# EAGLE design Control (EAGLE 9.6.2)
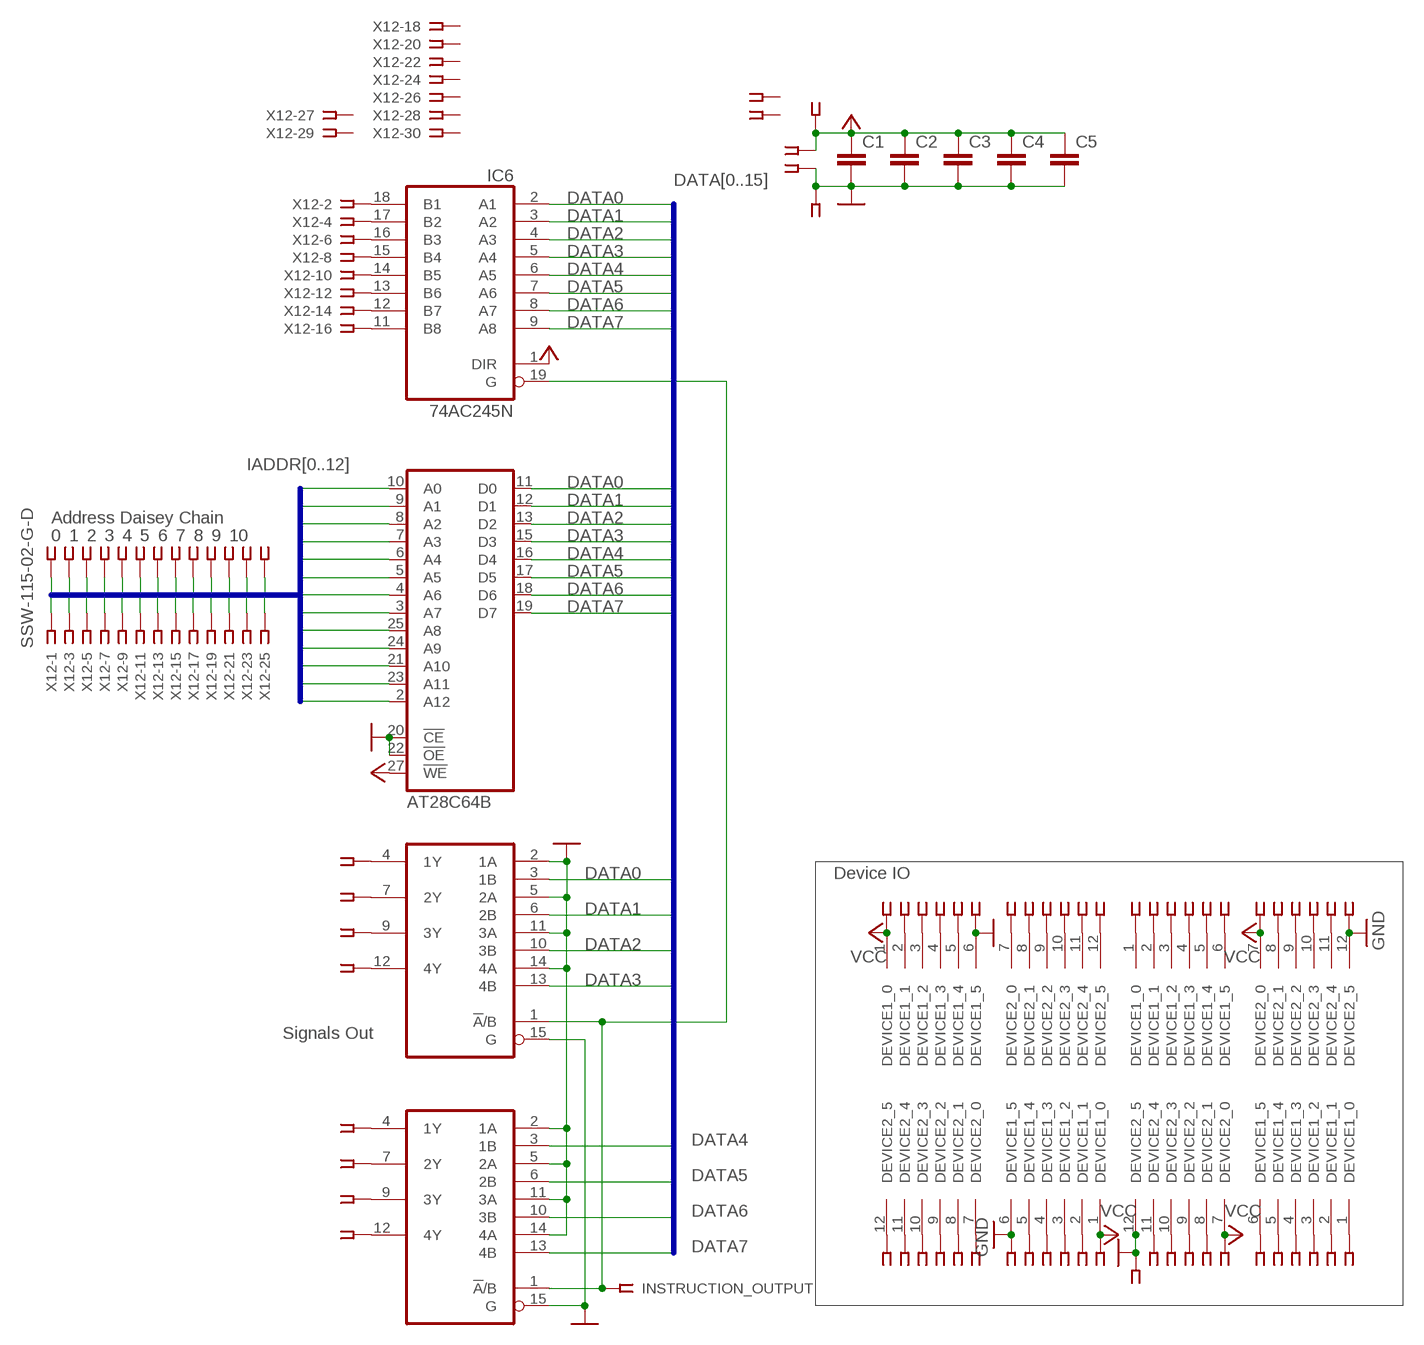
[diagram p0: schematic, sheet 1]

## Parts
C1  C2.5/2  [C2.5-2]
C2  C2.5/2  [C2.5-2]
C3  C2.5/2  [C2.5-2]
C4  C2.5/2  [C2.5-2]
C5  C2.5/2  [C2.5-2]
IC4  74AC157N  [DIL16]
IC5  74AC157N  [DIL16]
IC6  74AC245N  [DIL20]
INSTRUCTION_OUTPUT  SSW-101-02-G-S  [SSW-101-02-G-S]
U$1  CONTROL_SIG-INT  [CONTROL_SIG-INT-FOOT]
U$2  CONTROL_SIG-INT  [CONTROL_SIG-INT-FOOT]
U$3  AT28C64B  [DIP28-WIDE]
U$4  CONTROL_SIG-INT  [CONTROL_SIG-INT-FOOT]
U$5  CONTROL_SIG-INT  [CONTROL_SIG-INT-FOOT]
X1  SSW-106-02-G-S  [SSW-106-02-G-S]
X2  SSW-106-02-G-S  [SSW-106-02-G-S]
X3  SSW-106-02-G-S  [SSW-106-02-G-S]
X4  SSW-106-02-G-S  [SSW-106-02-G-S]
X5  SSW-108-02-G-S  [SSW-108-02-G-S]
X6  SSW-106-02-G-S  [SSW-106-02-G-S]
X7  SSW-106-02-G-S  [SSW-106-02-G-S]
X8  SSW-106-02-G-S  [SSW-106-02-G-S]
X9  SSW-106-02-G-S  [SSW-106-02-G-S]
X10  SSW-113-02-G-S  [SSW-113-02-G-S]
X11  SSW-102-02-G-S  [SSW-102-02-G-S]
X12  SSW-115-02-G-D  [SSW-115-02-G-D]
X13  SSW-104-02-G-S  [SSW-104-02-G-S]

## Nets
DATA0: IC4.3(1B) IC6.2(A1) U$3.11(D0)
DATA1: IC4.6(2B) IC6.3(A2) U$3.12(D1)
DATA2: IC4.10(3B) IC6.4(A3) U$3.13(D2)
DATA3: IC4.13(4B) IC6.5(A4) U$3.15(D3)
DATA4: IC5.3(1B) IC6.6(A5) U$3.16(D4)
DATA5: IC5.6(2B) IC6.7(A6) U$3.17(D5)
DATA6: IC5.10(3B) IC6.8(A7) U$3.18(D6)
DATA7: IC5.13(4B) IC6.9(A8) U$3.19(D7)
GND: C1.2 C2.2 C3.2 C4.2 C5.2 IC4.2(1A) IC4.5(2A) IC4.11(3A) IC4.14(4A) IC4.15(G) IC5.2(1A) IC5.5(2A) IC5.11(3A) IC5.14(4A) IC5.15(G) U$1.6(DEVICE1_5) U$2.12(DEVICE2_5) U$3.20(!CE) U$3.22(!OE) U$4.12(DEVICE2_5) U$5.6(DEVICE1_5) X1.1 X4.1 X7.1 X8.1 X11.2 X13.4
IADDR0: U$3.10(A0) X10.13 X12.1
IADDR1: U$3.9(A1) X10.12 X12.3
IADDR2: U$3.8(A2) X10.11 X12.5
IADDR3: U$3.7(A3) X10.10 X12.7
IADDR4: U$3.6(A4) X10.9 X12.9
IADDR5: U$3.5(A5) X10.8 X12.11
IADDR6: U$3.4(A6) X10.7 X12.13
IADDR7: U$3.3(A7) X10.6 X12.15
IADDR8: U$3.25(A8) X10.5 X12.17
IADDR9: U$3.24(A9) X10.4 X12.19
IADDR10: U$3.21(A10) X10.3 X12.21
IADDR11: U$3.23(A11) X10.2 X12.23
IADDR12: U$3.2(A12) X10.1 X12.25
N$1: U$2.6(DEVICE1_5) X6.1
N$2: U$2.5(DEVICE1_4) X6.2
N$3: U$2.4(DEVICE1_3) X6.3
N$4: U$2.3(DEVICE1_2) X6.4
N$5: U$2.2(DEVICE1_1) X6.5
N$6: U$2.1(DEVICE1_0) X6.6
N$8: U$2.11(DEVICE2_4) X7.2
N$9: U$2.10(DEVICE2_3) X7.3
N$10: U$2.9(DEVICE2_2) X7.4
N$11: U$2.8(DEVICE2_1) X7.5
N$13: U$4.6(DEVICE1_5) X3.1
N$14: U$4.5(DEVICE1_4) X3.2
N$15: U$4.4(DEVICE1_3) X3.3
N$16: U$4.3(DEVICE1_2) X3.4
N$17: U$4.2(DEVICE1_1) X3.5
N$18: U$4.1(DEVICE1_0) X3.6
N$20: U$4.11(DEVICE2_4) X4.2
N$21: U$4.10(DEVICE2_3) X4.3
N$22: U$4.9(DEVICE2_2) X4.4
N$23: U$4.8(DEVICE2_1) X4.5
N$26: U$5.5(DEVICE1_4) X1.2
N$27: U$5.4(DEVICE1_3) X1.3
N$28: U$5.3(DEVICE1_2) X1.4
N$29: U$5.2(DEVICE1_1) X1.5
N$31: U$5.12(DEVICE2_5) X2.1
N$32: U$5.11(DEVICE2_4) X2.2
N$33: U$5.10(DEVICE2_3) X2.3
N$34: U$5.9(DEVICE2_2) X2.4
N$35: U$5.8(DEVICE2_1) X2.5
N$36: U$5.7(DEVICE2_0) X2.6
N$38: U$1.5(DEVICE1_4) X8.2
N$39: U$1.4(DEVICE1_3) X8.3
N$40: U$1.3(DEVICE1_2) X8.4
N$41: U$1.2(DEVICE1_1) X8.5
N$43: U$1.12(DEVICE2_5) X9.1
N$44: U$1.11(DEVICE2_4) X9.2
N$45: U$1.10(DEVICE2_3) X9.3
N$46: U$1.9(DEVICE2_2) X9.4
N$47: U$1.8(DEVICE2_1) X9.5
N$48: U$1.7(DEVICE2_0) X9.6
N$49: IC6.18(B1) X12.2
N$50: IC6.17(B2) X12.4
N$51: IC6.16(B3) X12.6
N$52: IC6.15(B4) X12.8
N$53: IC6.14(B5) X12.10
N$54: IC6.13(B6) X12.12
N$55: IC6.12(B7) X12.14
N$56: IC6.11(B8) X12.16
N$101: IC5.12(4Y) X5.1
N$102: IC5.9(3Y) X5.2
N$104: IC4.1(!A!/B) IC5.1(!A!/B) IC6.19(G) INSTRUCTION_OUTPUT.1
N$105: IC5.7(2Y) X5.3
N$106: IC5.4(1Y) X5.4
N$107: IC4.12(4Y) X5.5
N$108: IC4.9(3Y) X5.6
N$109: IC4.7(2Y) X5.7
N$110: IC4.4(1Y) X5.8
VCC: C1.1 C2.1 C3.1 C4.1 C5.1 IC6.1(DIR) U$1.1(DEVICE1_0) U$2.7(DEVICE2_0) U$3.27(!WE) U$4.7(DEVICE2_0) U$5.1(DEVICE1_0) X1.6 X4.6 X7.6 X8.6 X11.1 X13.1
Unconnected: U$3.1 U$3.26 X12.18 X12.20 X12.22 X12.24 X12.26 X12.27 X12.28 X12.29 X12.30 X13.2 X13.3

## Buses
IADDR[0..12]
DATA[0..15]

## Notes on the sheet
- Address Daisey Chain
- 0 | 1 | 2 | 3 | 4 | 5 | 6 | 7 | 8 | 9 | 10
- Device IO
- Signals Out

## Power pins joined to a net without a drawn wire
GND: IC4.8(GND) IC5.8(GND) IC6.10(GND) U$3.14(GND)
VCC: IC4.16(VCC) IC5.16(VCC) IC6.20(VCC) U$3.28(VCC)

## Library data of the parts
C1-C5 = capacitor-wima:C: CAPACITOR naming: grid - package width
IC4 IC5 = 74xx-eu:74*157: Quadruple 2-line to 1-line data SELECTOR/MULTIPLEXER
IC6 = 74xx-eu:74*245: Octal BUS TRANSCEIVER, 3-state
INSTRUCTION_OUTPUT = con-samtec:SSW-101-02-G-S: THROUGH-HOLE .025" SQ POST SOCKET Source: Samtec SSW.pdf; MF: Samtec Inc.; MPN: SSW-101-02-G-S; OC_FARNELL: unknown; OC_NEWARK: 11P9336
U$1 U$2 U$4 U$5 = Computer:CONTROL_SIG-INT
U$3 = Computer:AT28C64B
X1-X4 X6-X9 = con-samtec:SSW-106-02-G-S: THROUGH-HOLE .025" SQ POST SOCKET Source: Samtec SSW.pdf; MF: Samtec Inc.; MPN: SSW-106-02-G-S; OC_FARNELL: unknown; OC_NEWARK: 11P9416
X5 = con-samtec:SSW-108-02-G-S: THROUGH-HOLE .025" SQ POST SOCKET Source: Samtec SSW.pdf; MF: Samtec Inc.; MPN: SSW-108-02-G-S; OC_FARNELL: unknown; OC_NEWARK: 11P9448
X10 = con-samtec:SSW-113-02-G-S: THROUGH-HOLE .025" SQ POST SOCKET Source: Samtec SSW.pdf; MF: Samtec Inc.; MPN: SSW-113-02-G-S; OC_FARNELL: unknown; OC_NEWARK: 11P9532
X11 = con-samtec:SSW-102-02-G-S: THROUGH-HOLE .025" SQ POST SOCKET Source: Samtec SSW.pdf; MF: Samtec Inc.; MPN: SSW-102-02-G-S; OC_FARNELL: unknown; OC_NEWARK: 11P9351
X12 = con-samtec:SSW-115-02-G: THROUGH-HOLE .025" SQ POST SOCKET Source: Samtec SSW.pdf; MF: Samtec Inc.; MPN: SSW-115-02-G-D; OC_FARNELL: unknown; OC_NEWARK: 11P9563
X13 = con-samtec:SSW-104-02-G-S: THROUGH-HOLE .025" SQ POST SOCKET Source: Samtec SSW.pdf; MF: Samtec Inc.; MPN: SSW-104-02-G-S; OC_FARNELL: unknown; OC_NEWARK: 11P9384

## Board
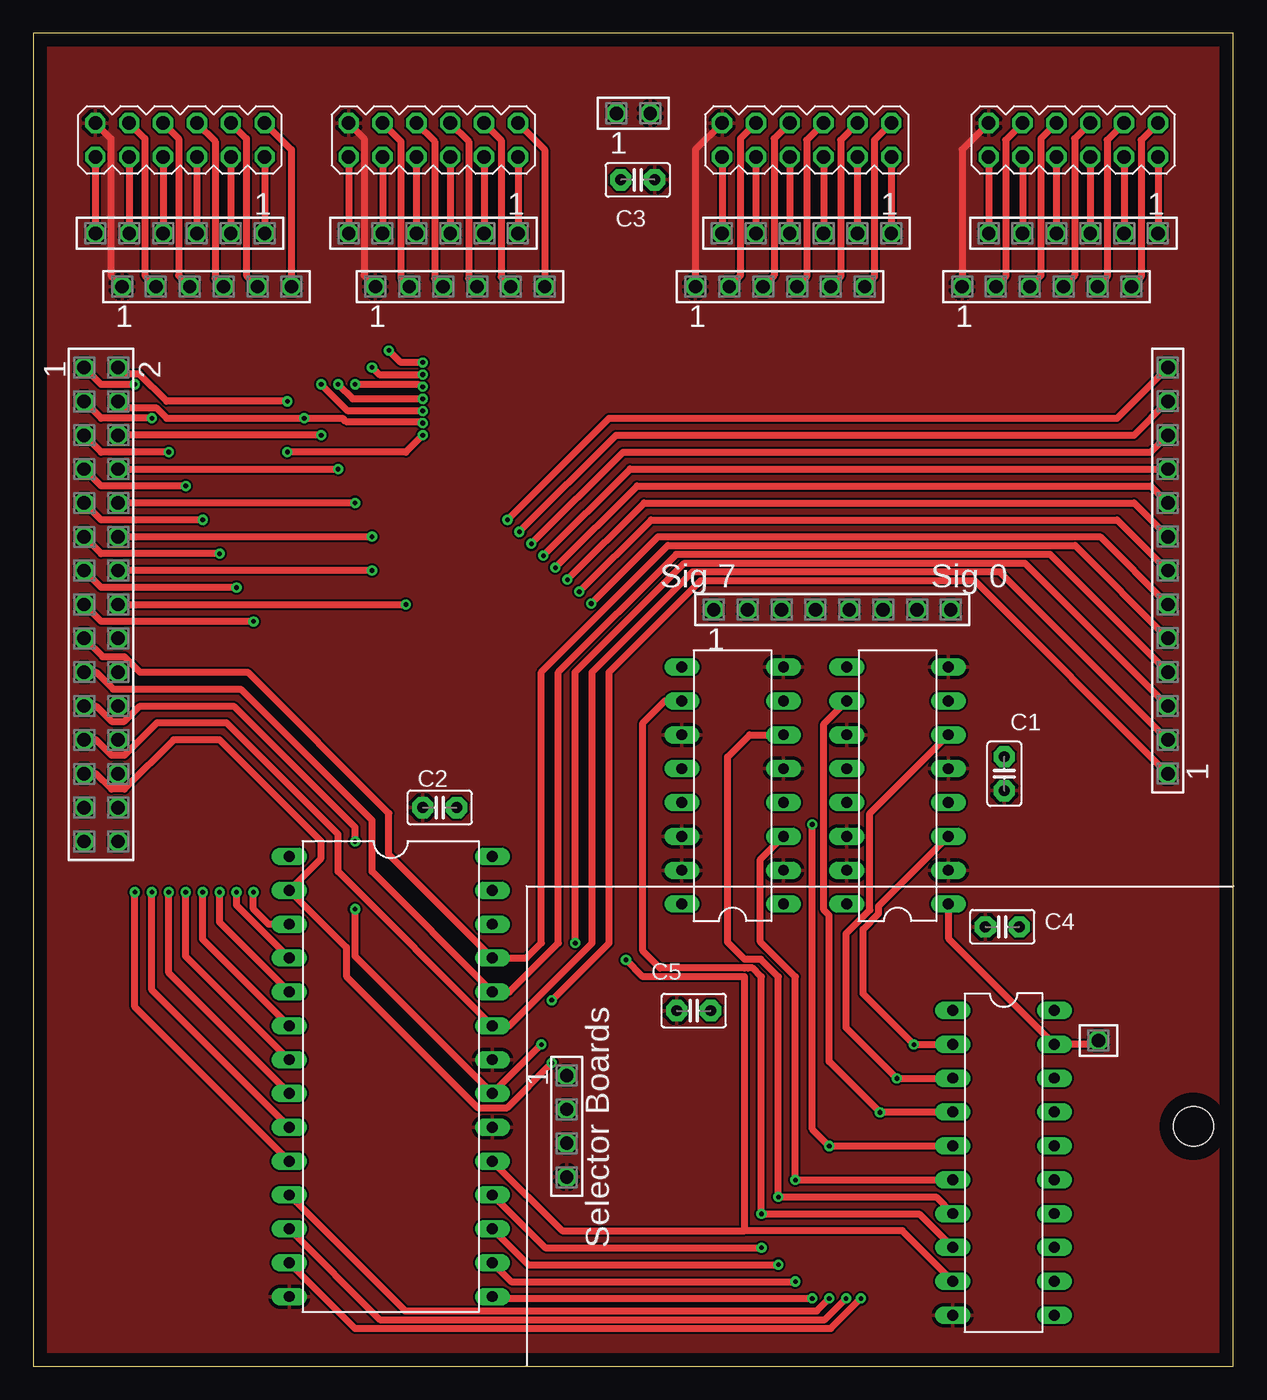
[diagram p1: board, top side]
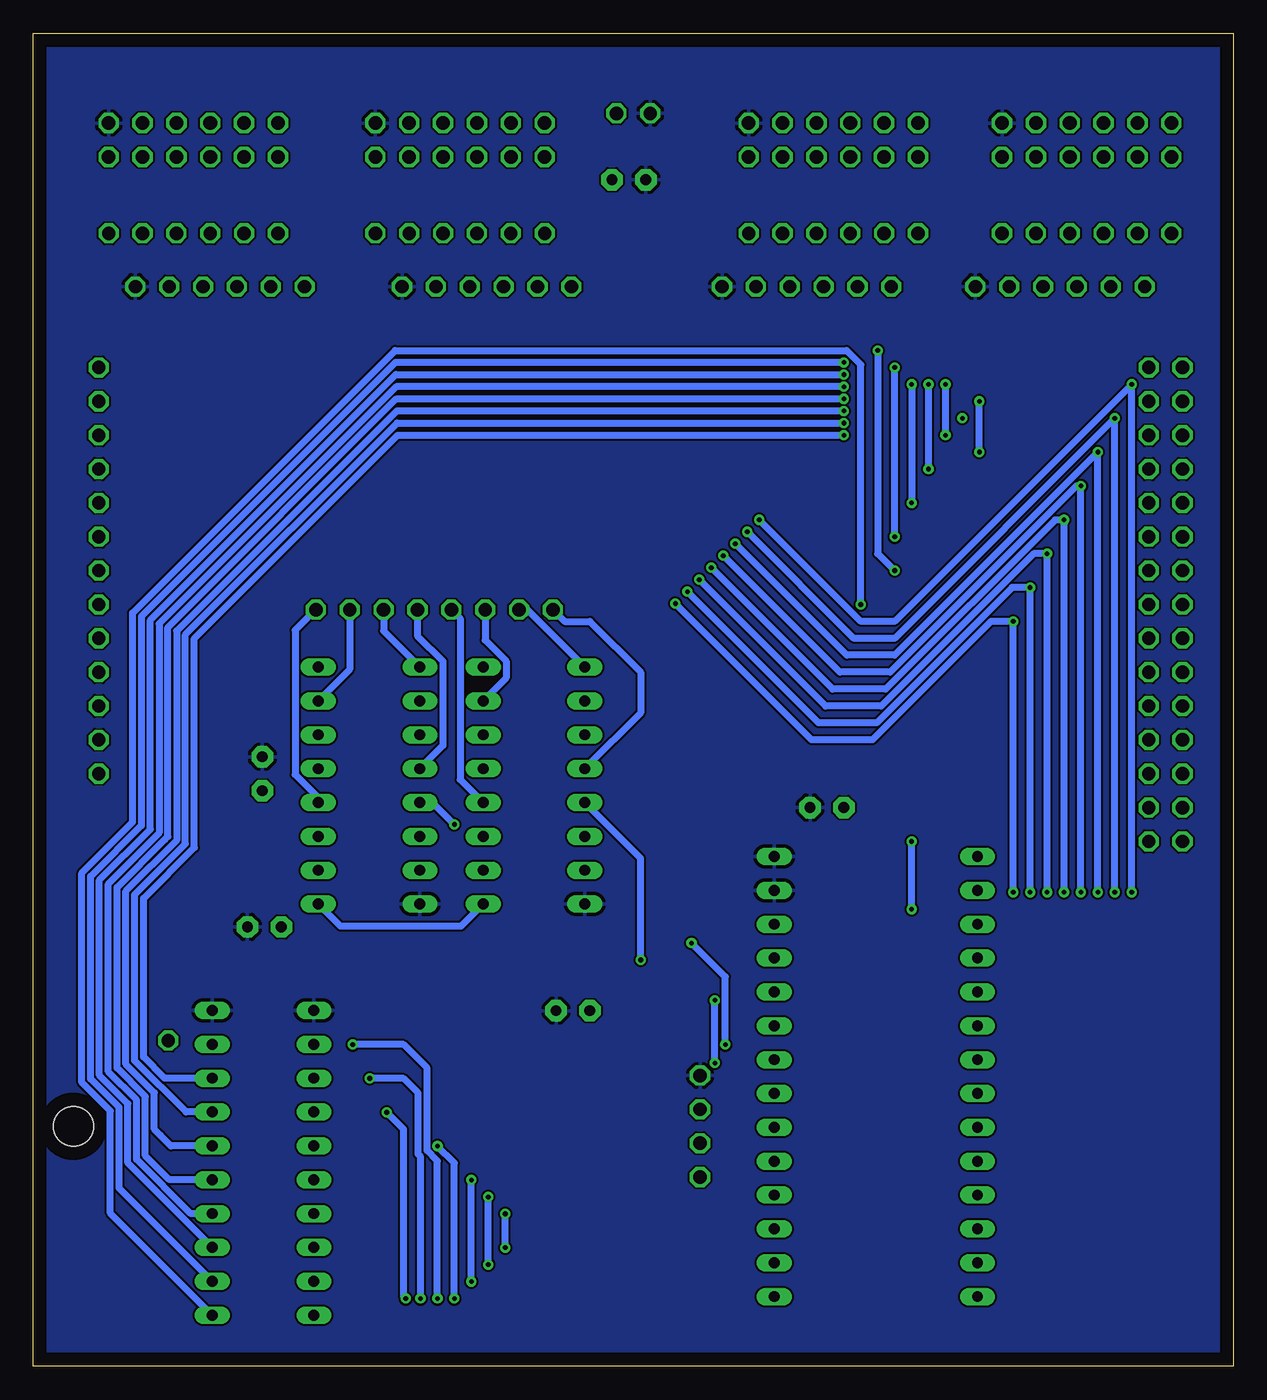
[diagram p2: board, bottom side, seen from below]

Size 90 x 100 mm. Coordinates in mm from the lower left corner, seen from the top.
Outline: 0,0 90,0 90,100 0,100 0,0
Copper layers (1*16): Top 0.035mm / dielectric 1.5mm / Bottom 0.035mm
Design rules "default": minimum track width 6mil, minimum drill 0.35mm, track to track 6mil, track to pad 6mil, pad to pad 6mil, via to via 6mil, smd to smd 6mil, copper to edge 40mil, drill to drill 6mil, minimum pad ring 10mil, minimum via ring 8mil, stop-mask expansion 4mil, vias tented up to drill 0mil, thermal gap 10mil
Holes 3 mm at 87,18

### Footprints (pad centres in the part's own frame; a part is rotated, then mirrored left to right if it is on the bottom)
C2.5-2 = drill 0.813 pad 1.6 octagon: 1 -1.27,0; 2 1.27,0
DIL16 = drill 0.813 long: 1 -8.89,-3.81; 2 -6.35,-3.81; 3 -3.81,-3.81; 4 -1.27,-3.81; 5 1.27,-3.81; 6 3.81,-3.81; 7 6.35,-3.81; 8 8.89,-3.81; 9 8.89,3.81; 10 6.35,3.81; 11 3.81,3.81; 12 1.27,3.81; 13 -1.27,3.81; 14 -3.81,3.81; 15 -6.35,3.81; 16 -8.89,3.81
DIL20 = drill 0.813 long: 1 -11.43,-3.81; 2 -8.89,-3.81; 3 -6.35,-3.81; 4 -3.81,-3.81; 5 -1.27,-3.81; 6 1.27,-3.81; 7 3.81,-3.81; 8 6.35,-3.81; 9 8.89,-3.81; 10 11.43,-3.81; 11 11.43,3.81; 12 8.89,3.81; 13 6.35,3.81; 14 3.81,3.81; 15 1.27,3.81; 16 -1.27,3.81; 17 -3.81,3.81; 18 -6.35,3.81; 19 -8.89,3.81; 20 -11.43,3.81
SSW-101-02-G-S = drill 1 pad 1.5 octagon: 1 0,0
CONTROL_SIG-INT-FOOT = drill 1.016 octagon: 1 -6.35,-1.27; 2 -3.81,-1.27; 3 -1.27,-1.27; 4 1.27,-1.27; 5 3.81,-1.27; 6 6.35,-1.27; 7 6.35,1.27; 8 3.81,1.27; 9 1.27,1.27; 10 -1.27,1.27; 11 -3.81,1.27; 12 -6.35,1.27
DIP28-WIDE = drill 0.813 long: 1 -16.51,-7.62; 2 -13.97,-7.62; 3 -11.43,-7.62; 4 -8.89,-7.62; 5 -6.35,-7.62; 6 -3.81,-7.62; 7 -1.27,-7.62; 8 1.27,-7.62; 9 3.81,-7.62; 10 6.35,-7.62; 11 8.89,-7.62; 12 11.43,-7.62; 13 13.97,-7.62; 14 16.51,-7.62; 15 16.51,7.62; 16 13.97,7.62; 17 11.43,7.62; 18 8.89,7.62; 19 6.35,7.62; 20 3.81,7.62; 21 1.27,7.62; 22 -1.27,7.62; 23 -3.81,7.62; 24 -6.35,7.62; 25 -8.89,7.62; 26 -11.43,7.62; 27 -13.97,7.62; 28 -16.51,7.62
SSW-106-02-G-S = drill 1 pad 1.5 octagon: 1 -6.35,0; 2 -3.81,0; 3 -1.27,0; 4 1.27,0; 5 3.81,0; 6 6.35,0
SSW-108-02-G-S = drill 1 pad 1.5 octagon: 1 -8.89,0; 2 -6.35,0; 3 -3.81,0; 4 -1.27,0; 5 1.27,0; 6 3.81,0; 7 6.35,0; 8 8.89,0
SSW-113-02-G-S = drill 1 pad 1.5 octagon: 1 -15.24,0; 2 -12.7,0; 3 -10.16,0; 4 -7.62,0; 5 -5.08,0; 6 -2.54,0; 7 0,0; 8 2.54,0; 9 5.08,0; 10 7.62,0; 11 10.16,0; 12 12.7,0; 13 15.24,0
SSW-102-02-G-S = drill 1 pad 1.5 octagon: 1 -1.27,0; 2 1.27,0
SSW-115-02-G-D = drill 1 pad 1.5 octagon: 1 -17.78,-1.27; 2 -17.78,1.27; 3 -15.24,-1.27; 4 -15.24,1.27; 5 -12.7,-1.27; 6 -12.7,1.27; 7 -10.16,-1.27; 8 -10.16,1.27; 9 -7.62,-1.27; 10 -7.62,1.27; 11 -5.08,-1.27; 12 -5.08,1.27; 13 -2.54,-1.27; 14 -2.54,1.27; 15 0,-1.27; 16 0,1.27; 17 2.54,-1.27; 18 2.54,1.27; 19 5.08,-1.27; 20 5.08,1.27; 21 7.62,-1.27; 22 7.62,1.27; 23 10.16,-1.27; 24 10.16,1.27; 25 12.7,-1.27; 26 12.7,1.27; 27 15.24,-1.27; 28 15.24,1.27; 29 17.78,-1.27; 30 17.78,1.27
SSW-104-02-G-S = drill 1 pad 1.5 octagon: 1 -3.81,0; 2 -1.27,0; 3 1.27,0; 4 3.81,0

### Placement (x,y rotation side)
C1  72.82,44.45 270 top
C2  30.48,41.91 180 top
C3  45.33,89.01 0 top
C4  72.67,32.96 180 top
C5  49.53,26.67 180 top
IC4  64.82,43.56 90 top
IC5  52.45,43.56 90 top
IC6  72.77,15.26 270 top
INSTRUCTION_OUTPUT  79.88,24.43 0 top
U$1  78,92 180 top
U$2  58,92 0 top
U$3  26.81,21.73 270 top
U$4  30,92 0 top
U$5  11,92 180 top
X1  13,81 0 top
X2  11,85 180 top
X3  30,85 180 top
X4  32,81 0 top
X5  59.92,56.76 0 top
X6  58,85 180 top
X7  56,81 0 top
X8  76,81 0 top
X9  78,85 180 top
X10  85.09,59.69 90 top
X11  45,94 0 top
X12  5.08,57.15 270 top
X13  40,18 270 top

### Tracks (layer width: path | path; a pad name or v marks a point on that pad's centre or on a via)
DATA0  (via drill 0.35)
  Top 0.508: U$3.11 27.88,4.15 58.76,4.15 v59.69,5.08 | IC6.2 68.94,24.13 v66.04,24.13 62.23,27.94 62.23,32.79 63.4,33.95 63.4,34.52 IC4.3
  Bottom 0.508: v59.69,5.08 59.69,15.4 60.48,16.18 60.48,22.38 62.23,24.13 v66.04,24.13
DATA1  (via drill 0.35)
  Top 0.508: U$3.12 26,3.49 59.37,3.49 v60.96,5.08 | IC6.3 64.79,21.61 v64.77,21.59 60.96,25.4 60.96,32.45 62.74,34.23 62.74,41.48 IC4.6
  Bottom 0.508: v60.96,5.08 60.96,15.74 61.13,15.91 61.13,20.5 62.23,21.59 v64.77,21.59
DATA2  (via drill 0.35)
  Top 0.508: U$3.13 24.12,2.83 59.82,2.83 v62.07,5.08 | IC6.4 63.52,19.07 v63.5,19.05 59.69,22.86 59.69,33.82 59.28,34.23 59.28,48.18 IC4.10
  Bottom 0.508: v62.07,5.08 62.23,5.24 62.23,17.78 v63.5,19.05
DATA3  (via drill 0.35)
  Top 0.508: U$3.15 34.57,5.08 v58.42,5.08 | IC6.5 59.71,16.53 v59.69,16.51 58.42,17.78 v58.42,40.64
  Bottom 0.508: v58.42,5.08 58.42,15.24 v59.69,16.51 | v58.42,40.64 60.07,42.29 IC4.13
DATA4  (via drill 0.35)
  Top 0.508: U$3.16 35.84,6.35 v57.15,6.35 | IC6.6 57.17,13.99 v57.15,13.97 57.15,29.21 54.53,31.83 54.53,38.02 IC5.3
  Bottom 0.508: v57.15,6.35 v57.15,13.97
DATA5  (via drill 0.35)
  Top 0.508: U$3.17 37.11,7.62 v55.88,7.62 | IC6.7 67.71,12.7 v55.88,12.7 55.88,29.21 54.56,30.53 53.34,30.53 52.07,31.8 52.07,45.72 53.72,47.37 IC5.6
  Bottom 0.508: v55.88,7.62 v55.88,12.7
DATA6  (via drill 0.35)
  Top 0.508: U$3.18 38.38,8.89 v54.61,8.89 | IC6.8 66.44,11.43 v54.61,11.43 54.61,29.21 53.95,29.87 53.61,29.87 53.34,29.87 46.99,29.87 45.72,31.14 45.72,48.26 47.37,49.91 IC5.10
  Bottom 0.508: v54.61,8.89 v54.61,11.43
DATA7  (via drill 0.35)
  Top 0.508: U$3.19 39.65,10.16 53.34,10.16 | IC6.9 65.17,10.16 53.34,10.16 | 53.34,10.16 53.34,29.21 45.72,29.21 v44.45,30.48
  Bottom 0.508: v44.45,30.48 44.45,38.1 IC5.13
GND
  Top 0.508: X1.1 5.82,81.83 5.82,92.1 U$5.6 | X4.1 24.82,81.83 24.82,92.1 U$4.12 | X7.1 49.65,91.27 U$2.12 | X8.1 69.65,91.27 U$1.6
  pour Top: 0,100 90,100 90,0 0,0
IADDR0  (via drill 0.35)
  Top 0.508: U$3.10 7.62,26.95 v7.62,35.56 | v7.62,73.66 5.08,73.66 X12.1 | v35.56,63.5 43.18,71.12 81.28,71.12 X10.13
  Bottom 0.508: v7.62,35.56 v7.62,73.66 25.4,55.88 27.94,55.88 v35.56,63.5
IADDR1  (via drill 0.35)
  Top 0.508: U$3.9 8.89,28.22 v8.89,35.56 | v8.89,71.12 5.08,71.12 X12.3 | v36.46,62.6 43.71,69.85 82.55,69.85 X10.12
  Bottom 0.508: v8.89,35.56 v8.89,71.12 25.4,54.61 28.47,54.61 v36.46,62.6
IADDR2  (via drill 0.35)
  Top 0.508: U$3.8 10.16,29.49 v10.16,35.56 | v10.16,68.58 5.08,68.58 X12.5 | v37.36,61.7 44.23,68.58 83.82,68.58 X10.11
  Bottom 0.508: v10.16,35.56 v10.16,68.58 25.4,53.34 28.99,53.34 v37.36,61.7
IADDR3  (via drill 0.35)
  Top 0.508: U$3.7 11.43,30.76 v11.43,35.56 | v11.43,66.04 5.08,66.04 X12.7 | v38.25,60.81 44.76,67.31 X10.10
  Bottom 0.508: v11.43,35.56 v11.43,66.04 11.77,66.04 25.74,52.07 29.52,52.07 v38.25,60.81
IADDR4  (via drill 0.35)
  Top 0.508: U$3.6 12.7,32.03 v12.7,35.56 | v12.7,63.5 5.08,63.5 X12.9 | v39.15,59.91 45.28,66.04 83.82,66.04 X10.9
  Bottom 0.508: v12.7,35.56 v12.7,63.5 13.37,63.5 26.07,50.8 30.04,50.8 v39.15,59.91
IADDR5  (via drill 0.35)
  Top 0.508: U$3.5 13.97,33.3 v13.97,35.56 | v13.97,60.96 5.08,60.96 X12.11 | v40.05,59.01 45.81,64.77 82.55,64.77 X10.8
  Bottom 0.508: v13.97,35.56 v13.97,60.96 14.98,60.96 26.41,49.53 30.57,49.53 v40.05,59.01
IADDR6  (via drill 0.35)
  Top 0.508: U$3.4 15.24,34.57 v15.24,35.56 | v15.24,58.42 5.08,58.42 X12.13 | v40.95,58.11 46.34,63.5 81.28,63.5 X10.7
  Bottom 0.508: v15.24,35.56 v15.24,58.42 16.58,58.42 26.74,48.26 31.1,48.26 v40.95,58.11
IADDR7  (via drill 0.35)
  Top 0.508: U$3.3 17.64,33.16 16.51,34.29 v16.51,35.56 | v16.51,55.88 5.08,55.88 X12.15 | v41.85,57.21 46.86,62.23 80.01,62.23 X10.6
  Bottom 0.508: v16.51,35.56 v16.51,55.88 18.19,55.88 27.08,46.99 31.62,46.99 v41.85,57.21
IADDR8
  Top 0.508: X12.17 5.19,53.23 6.83,53.23 7.99,52.07 16.07,52.07 26.67,41.47 26.67,38.38 U$3.25 36.97,30.62 38.1,31.75 38.1,52.07 47.6,61.57 78.13,61.57 X10.5
IADDR9
  Top 0.508: X12.19 4.71,52.07 5.98,50.8 15.55,50.8 25.4,40.95 25.4,37.11 U$3.24 35.7,28.08 39.37,31.75 39.37,52.07 48.21,60.91 76.25,60.91 X10.4
IADDR10  (via drill 0.35)
  Top 0.508: v24.13,34.29 24.13,30.76 U$3.21 v38.1,24.13 | v24.13,39.37 24.13,40.42 15.02,49.53 7.99,49.53 6.83,48.37 5.87,48.37 4.71,49.53 X12.21 | v40.64,31.75 40.64,52.07 48.82,60.25 74.37,60.25 X10.3
  Bottom 0.508: v24.13,34.29 v24.13,39.37 | v38.1,24.13 38.1,29.21 v40.64,31.75
IADDR11
  Top 0.508: X12.23 4.71,46.99 5.87,45.83 6.83,45.83 9.26,48.26 14.5,48.26 22.86,39.9 22.86,37.11 U$3.23 35.7,25.54 41.91,31.75 41.91,52.07 49.43,59.59 72.49,59.59 X10.2
IADDR12  (via drill 0.35)
  Top 0.508: X12.25 4.71,44.45 5.87,43.29 6.83,43.29 10.53,46.99 13.97,46.99 21.59,39.37 21.59,38.1 U$3.2 23.47,31.42 23.47,29.25 33.33,19.39 35.53,19.39 v38.88,22.75 | v38.88,27.45 43.18,31.75 43.18,52.07 50.04,58.93 70.61,58.93 X10.1
  Bottom 0.508: v38.88,22.75 v38.88,27.45
N$1
  Top 0.508: U$2.6 X6.1
N$2
  Top 0.508: U$2.5 X6.2
N$3
  Top 0.508: U$2.4 X6.3
N$4
  Top 0.508: U$2.3 X6.4
N$5
  Top 0.508: U$2.2 X6.5
N$6
  Top 0.508: U$2.1 X6.6
N$8
  Top 0.508: X7.2 53.02,81.83 53.02,92.1 U$2.11
N$9
  Top 0.508: X7.3 55.56,81.83 55.56,92.1 U$2.10
N$10
  Top 0.508: X7.4 58,81.73 58,92 U$2.9
N$11
  Top 0.508: X7.5 60.54,81.73 60.54,92 U$2.8
N$13
  Top 0.508: U$4.6 X3.1
N$14
  Top 0.508: U$4.5 X3.2
N$15
  Top 0.508: U$4.4 X3.3
N$16
  Top 0.508: U$4.3 X3.4
N$17
  Top 0.508: U$4.2 X3.5
N$18
  Top 0.508: U$4.1 X3.6
N$20
  Top 0.508: X4.2 27.56,81.63 27.56,91.9 U$4.11
N$21
  Top 0.508: X4.3 30.1,81.63 30.1,91.9 U$4.10
N$22
  Top 0.508: X4.4 32.64,81.63 32.64,91.9 U$4.9
N$23
  Top 0.508: X4.5 35.08,81.73 35.08,92 U$4.8
N$26
  Top 0.508: X1.2 8.36,81.83 8.36,92.1 U$5.5
N$27
  Top 0.508: X1.3 10.9,81.83 10.9,92.1 U$5.4
N$28
  Top 0.508: X1.4 13.64,81.63 13.64,91.9 U$5.3
N$29
  Top 0.508: X1.5 15.98,81.83 15.98,92.1 U$5.2
N$31
  Top 0.508: U$5.12 X2.1
N$32
  Top 0.508: U$5.11 X2.2
N$33
  Top 0.508: U$5.10 X2.3
N$34
  Top 0.508: U$5.9 X2.4
N$35
  Top 0.508: U$5.8 X2.5
N$36
  Top 0.508: U$5.7 X2.6
N$38
  Top 0.508: X8.2 72.92,81.73 72.92,92 U$1.5
N$39
  Top 0.508: X8.3 75.56,81.83 75.56,92.1 U$1.4
N$40
  Top 0.508: X8.4 78.1,81.83 78.1,92.1 U$1.3
N$41
  Top 0.508: X8.5 80.54,81.73 80.54,92 U$1.2
N$43
  Top 0.508: U$1.12 X9.1
N$44
  Top 0.508: U$1.11 X9.2
N$45
  Top 0.508: U$1.10 X9.3
N$46
  Top 0.508: U$1.9 X9.4
N$47
  Top 0.508: U$1.8 X9.5
N$48
  Top 0.508: U$1.7 X9.6
N$49  (via drill 0.35)
  Top 0.508: v29.21,69.85 27.94,68.58 v19.05,68.58 | X12.2 6.83,74.44 7.95,74.44 10,72.39 v19.05,72.39
  Bottom 0.508: IC6.18 80.16,21.61 81.74,23.19 81.74,35.1 77.93,38.91 77.93,54.61 62.69,69.85 v29.21,69.85 | v19.05,68.58 v19.05,72.39
N$50  (via drill 0.35)
  Top 0.508: X12.4 6.83,71.91 9.21,71.91 10,71.12 v20.32,71.12 23.2,71.12 23.43,70.88 29.09,70.88 v29.21,70.76
  Bottom 0.508: IC6.17 78.55,19.07 82.4,22.92 82.4,35.38 78.59,39.19 78.59,54.88 62.71,70.76 v29.21,70.76
N$51  (via drill 0.35)
  Top 0.508: v29.21,71.67 23.58,71.67 v21.59,73.66 | v21.59,69.85 X12.6
  Bottom 0.508: IC6.16 79.68,16.53 80.47,17.32 80.93,17.78 80.93,20.52 83.06,22.64 83.06,35.65 79.25,39.46 79.25,55.16 62.74,71.67 v29.21,71.67 | v21.59,73.66 v21.59,69.85
N$52  (via drill 0.35)
  Top 0.508: X12.8 v22.86,67.31 | v22.86,73.66 23.94,72.58 v29.21,72.58
  Bottom 0.508: IC6.15 79.79,13.99 81.59,15.79 81.59,20.24 83.72,22.37 83.72,35.92 80.14,39.5 79.91,39.73 79.91,55.43 62.76,72.58 v29.21,72.58 | v22.86,67.31 v22.86,73.66
N$53  (via drill 0.35)
  Top 0.508: v29.21,73.48 29.09,73.61 28.89,73.61 28.83,73.66 v24.13,73.66 | v24.13,64.77 X12.10
  Bottom 0.508: IC6.14 78.19,11.45 82.25,15.51 82.25,19.97 84.38,22.1 84.38,36.2 80.57,40.01 80.57,55.7 62.79,73.48 v29.21,73.48 | v24.13,73.66 v24.13,64.77
N$54  (via drill 0.35)
  Top 0.508: X12.12 v25.4,62.23 | v25.4,74.93 25.94,74.39 v29.21,74.39
  Bottom 0.508: IC6.13 82.91,15.24 82.91,19.69 85.04,21.82 85.04,36.47 81.23,40.28 81.23,55.98 62.81,74.39 v29.21,74.39 | v25.4,62.23 v25.4,74.93
N$55  (via drill 0.35)
  Top 0.508: v29.21,75.3 27.57,75.3 v26.67,76.2 | v25.4,59.69 X12.14
  Bottom 0.508: IC6.12 83.57,13.36 83.57,19.42 85.7,21.55 85.7,36.74 81.89,40.55 81.89,56.25 62.84,75.3 v29.21,75.3 | v26.67,76.2 26.67,60.96 v25.4,59.69
N$56  (via drill 0.35)
  Top 0.508: X12.16 v27.94,57.15
  Bottom 0.508: IC6.11 84.23,11.48 84.23,19.15 86.36,21.28 86.36,37.02 82.55,40.83 82.55,56.52 62.86,76.21 29.01,76.21 27.94,75.14 v27.94,57.15
N$101
  Bottom 0.508: IC5.12 44.45,49.02 44.45,52.07 48.26,55.88 50.15,55.88 X5.1
N$102
  Bottom 0.508: X5.2 52.95,56.76 IC5.9
N$104
  Top 0.508: INSTRUCTION_OUTPUT.1 79.6,24.15 IC6.19 68.63,32.1 IC4.1
  Bottom 0.508: IC4.1 66.98,33.02 57.91,33.02 IC5.1
N$105
  Bottom 0.508: X5.3 56.11,54.47 54.53,52.89 54.53,51.64 IC5.7
N$106
  Bottom 0.508: X5.4 57.99,56.1 57.99,44.02 IC5.4
N$107
  Bottom 0.508: X5.5 61.19,54.8 59.28,52.89 59.28,46.56 IC4.12
N$108
  Bottom 0.508: X5.6 63.73,55.17 IC4.9
N$109
  Bottom 0.508: X5.7 66.27,52.27 IC4.7
N$110
  Bottom 0.508: IC4.4 68.63,42.66 70.36,44.39 70.36,55.21 X5.8
VCC
  Top 0.508: X1.6 19.35,91.27 U$5.1 | X4.6 38.35,91.27 U$4.7 | X7.6 63.08,81.73 63.08,92 U$2.7 | X8.6 83.08,81.73 83.08,92 U$1.1
  pour Bottom: 0,100 90,100 90,0 0,0

### Text on the board
tPlace: Sig 7 | Sig 0 | Selector Boards
tValues: DB to output to the DB Backplane | Instruction Output